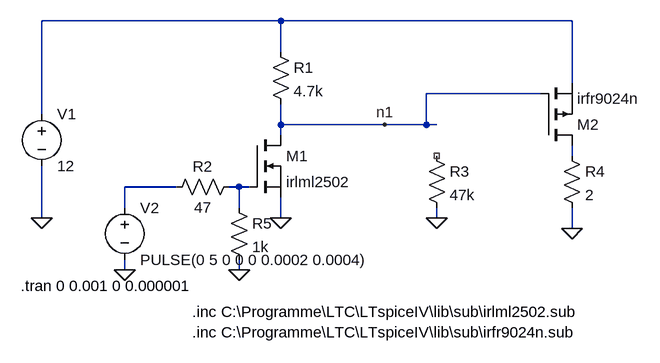
[diagram p0: schematic Draft1.asc]
Draft1.asc, the LTspice schematic file:
Version 4
SHEET 1 1480 680
WIRE 240 -48 -128 -48
WIRE 688 -48 240 -48
WIRE 240 0 240 -48
WIRE 688 48 688 -48
WIRE 640 64 464 64
WIRE -128 96 -128 -48
WIRE 240 112 240 80
WIRE 400 112 240 112
WIRE 464 112 464 64
WIRE 464 112 400 112
WIRE 480 112 464 112
WIRE 240 128 240 112
WIRE 688 160 688 144
WIRE 80 208 0 208
WIRE 176 208 160 208
WIRE 192 208 176 208
WIRE 0 240 0 208
WIRE 176 240 176 208
WIRE -128 256 -128 176
WIRE 240 256 240 224
WIRE 480 256 480 240
WIRE 688 272 688 240
WIRE 0 336 0 320
WIRE 176 336 176 320
FLAG 240 256 0
FLAG -128 256 0
FLAG 400 112 n1
FLAG 0 336 0
FLAG 480 256 0
FLAG 688 272 0
FLAG 176 336 0
SYMBOL nmos 192 128 R0
SYMATTR InstName M1
SYMATTR Value irlml2502
SYMATTR Prefix X
SYMBOL res 224 -16 R0
SYMATTR InstName R1
SYMATTR Value 4.7k
SYMBOL voltage -128 80 R0
WINDOW 123 0 0 Left 2
WINDOW 39 0 0 Left 2
SYMATTR InstName V1
SYMATTR Value 12
SYMBOL res 176 192 R90
WINDOW 0 0 56 VBottom 2
WINDOW 3 32 56 VTop 2
SYMATTR InstName R2
SYMATTR Value 47
SYMBOL voltage 0 224 R0
WINDOW 123 0 0 Left 2
WINDOW 39 0 0 Left 2
SYMATTR InstName V2
SYMATTR Value PULSE(0 5 0 0 0 0.0002 0.0004)
SYMBOL res 464 144 R0
SYMATTR InstName R3
SYMATTR Value 47k
SYMBOL res 672 144 R0
SYMATTR InstName R4
SYMATTR Value 2
SYMBOL pmos 640 144 M180
SYMATTR InstName M2
SYMATTR Value irfr9024n
SYMATTR Prefix X
SYMBOL res 160 224 R0
SYMATTR InstName R5
SYMATTR Value 1k
TEXT -160 360 Left 2 !.tran 0 0.001 0 0.000001
TEXT 104 400 Left 2 !.inc C:\\Programme\\LTC\\LTspiceIV\\lib\\sub\\irlml2502.sub
TEXT 104 432 Left 2 !.inc C:\\Programme\\LTC\\LTspiceIV\\lib\\sub\\irfr9024n.sub

The netlist it stands for:
* Draft1.asc
XM1 n1 N004 0 irlml2502  ; pins D G S
R1 N001 n1 4.7k
V1 N001 0 12
R2 N004 N003 47
V2 N003 0 PULSE(0 5 0 0 0 0.0002 0.0004)
R3 NC_01 0 47k
R4 N002 0 2
XM2 N002 n1 N001 irfr9024n  ; pins D G S
R5 N004 0 1k
.tran 0 0.001 0 0.000001
.inc C:\Programme\LTC\LTspiceIV\lib\sub\irlml2502.sub
.inc C:\Programme\LTC\LTspiceIV\lib\sub\irfr9024n.sub
.backanno
.end